# EAGLE design serial-converter (EAGLE 9.6.2)
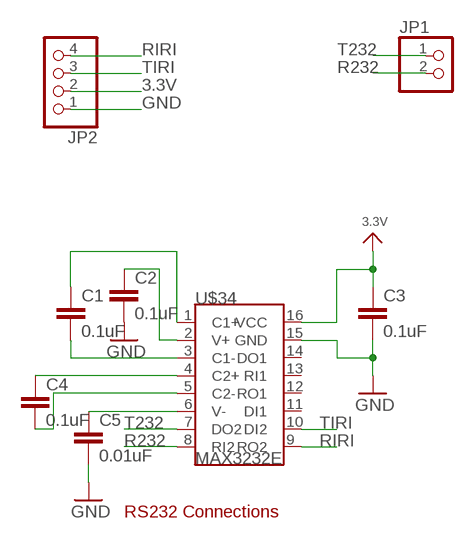
[diagram p0: schematic, sheet 1]

## Parts
C1  0.1uF  C-EUC0603  [C0603]
C2  0.1uF  C-EUC0603  [C0603]
C3  0.1uF  C-EUC0603  [C0603]
C4  0.1uF  C-EUC0603  [C0603]
C5  0.01uF  C-EUC0603  [C0603]
JP1  PINHD-1X2  [1X02]
JP2  PINHD-1X4  [1X04]
U$34  MAX3232E  [SSOP-16]

## Nets
3.3V: C3.1 JP2.2 U$34.16(VCC)
GND: C2.2 C3.2 C5.2 JP2.1 U$34.15(GND)
N$8: C1.1 U$34.1(C1+)
N$10: C1.2 U$34.3(C1-)
N$11: C4.1 U$34.4(C2+)
N$13: C4.2 U$34.5(C2-)
N$14: C5.1 U$34.6(V-)
N$17: C2.1 U$34.2(V+)
R232: JP1.2 U$34.8(RI2)
RIRI: JP2.4 U$34.9(RO2)
T232: JP1.1 U$34.7(DO2)
TIRI: JP2.3 U$34.10(DI2)
Unconnected: U$34.11(DI1) U$34.12(RO1) U$34.13(RI1) U$34.14(DO1)

## Notes on the sheet
- RS232 Connections

## Library data of the parts
C1-C5 = rcl:C-EU: CAPACITOR, European symbol; SPICEPREFIX: C
JP1 = pinhead:PINHD-1X2: PIN HEADER
JP2 = pinhead:PINHD-1X4: PIN HEADER
U$34 = TI_radio:MAX3232E: MAX3232 RS232 converter for use in 3.3-5V logic

## Board
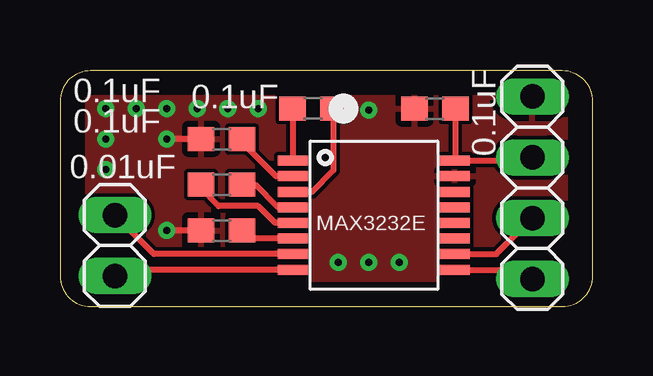
[diagram p1: board, top side]
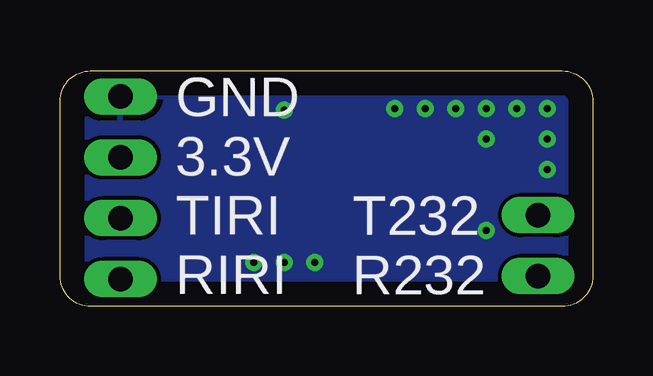
[diagram p2: board, bottom side, seen from below]

Size 22.2 x 9.83 mm. Coordinates in mm from the lower left corner, seen from the top.
Outline: 0,8.56 0,1.27 arc90 1.27,0 20.93,0 arc90 22.2,1.27 22.2,8.56 arc90 20.93,9.83 1.27,9.83 arc90 0,8.56
Copper layers (1*16): Top 0.035mm / dielectric 1.5mm / Bottom 0.035mm
Design rules "default *": minimum track width 6mil, minimum drill 0.35mm, track to track 6mil, track to pad 6mil, pad to pad 6mil, via to via 6mil, smd to smd 6mil, copper to edge 40mil, drill to drill 6mil, minimum pad ring 10mil, minimum via ring 8mil, stop-mask expansion 4mil, vias tented up to drill 14mil, thermal gap 10mil

### Footprints (pad centres in the part's own frame; a part is rotated, then mirrored left to right if it is on the bottom)
C0603 = smd 1.1 x 1: 1 -0.85,0; 2 0.85,0
1X02 = drill 1.016 long: 1 -1.27,0; 2 1.27,0
1X04 = drill 1.016 long: 1 -3.81,0; 2 -1.27,0; 3 1.27,0; 4 3.81,0
SSOP-16 = smd 0.42 x 1.25: 1 -2.275,-3.375; 2 -1.625,-3.375; 3 -0.975,-3.375; 4 -0.325,-3.375; 5 0.325,-3.375; 6 0.975,-3.375; 7 1.625,-3.375; 8 2.275,-3.375; 9 2.275,3.375; 10 1.625,3.375; 11 0.975,3.375; 12 0.325,3.375; 13 -0.325,3.375; 14 -0.975,3.375; 15 -1.625,3.375; 16 -2.275,3.375

### Placement (x,y rotation side)
C1  10.54,8.26 0 top
C2  6.73,6.99 180 top
C3  15.62,8.26 180 top
C4  6.73,5.08 180 top
C5  6.73,3.17 180 top
JP1  2.29,2.54 270 top
JP2  19.68,4.95 270 top
U$34  13.08,3.81 270 top

### Tracks (layer width: path | path; a pad name or v marks a point on that pad's centre or on a via)
3.3V
  Top 0.254: C3.1 16.47,6.1 U$34.16 19.55,6.08 JP2.2
GND  (via drill 0.3)
  Top 0.254: U$34.15 16.42,5.47 | C2.2 v4.45,6.99 | C5.2 v4.45,3.17
  other vias: 8.26,8.26 6.99,8.26 5.71,8.26 4.45,8.26 3.17,8.26 1.91,8.26 1.91,6.99 1.91,5.71 12.87,8.19 11.6,1.84 12.87,1.84 14.14,1.84
  pour Bottom: -0.64,-0.64 -0.64,10.16 22.86,10.16 22.86,-0.64
  pour Top: -0.64,10.16 -0.64,-0.64 22.86,-0.64 22.86,10.16
N$8
  Top 0.254: C1.1 9.69,6.1 U$34.1
N$10
  Top 0.254: C1.2 11.39,5.68 10.5,4.79 U$34.3
N$11
  Top 0.254: U$34.4 9.07,4.13 8.13,5.08 C4.1
N$13
  Top 0.254: U$34.5 8.96,3.48 8.26,4.19 6.6,4.19 5.88,4.91 C4.2
N$14
  Top 0.254: U$34.6 7.92,2.83 C5.1
N$17
  Top 0.254: C2.1 7.58,6.85 9,5.43 U$34.2
R232
  Top 0.254: U$34.8 2.55,1.53 JP1.2
RIRI
  Top 0.254: U$34.9 19.29,1.53 JP2.4
T232
  Top 0.254: U$34.7 3.91,2.19 JP1.1
TIRI
  Top 0.254: U$34.10 18.19,2.19 JP2.3

### Text on the board
bNames: T232 / R232 | GND / 3.3V / TIRI / RIRI